# EAGLE design BusBlaster-v1 (EAGLE 5.10)
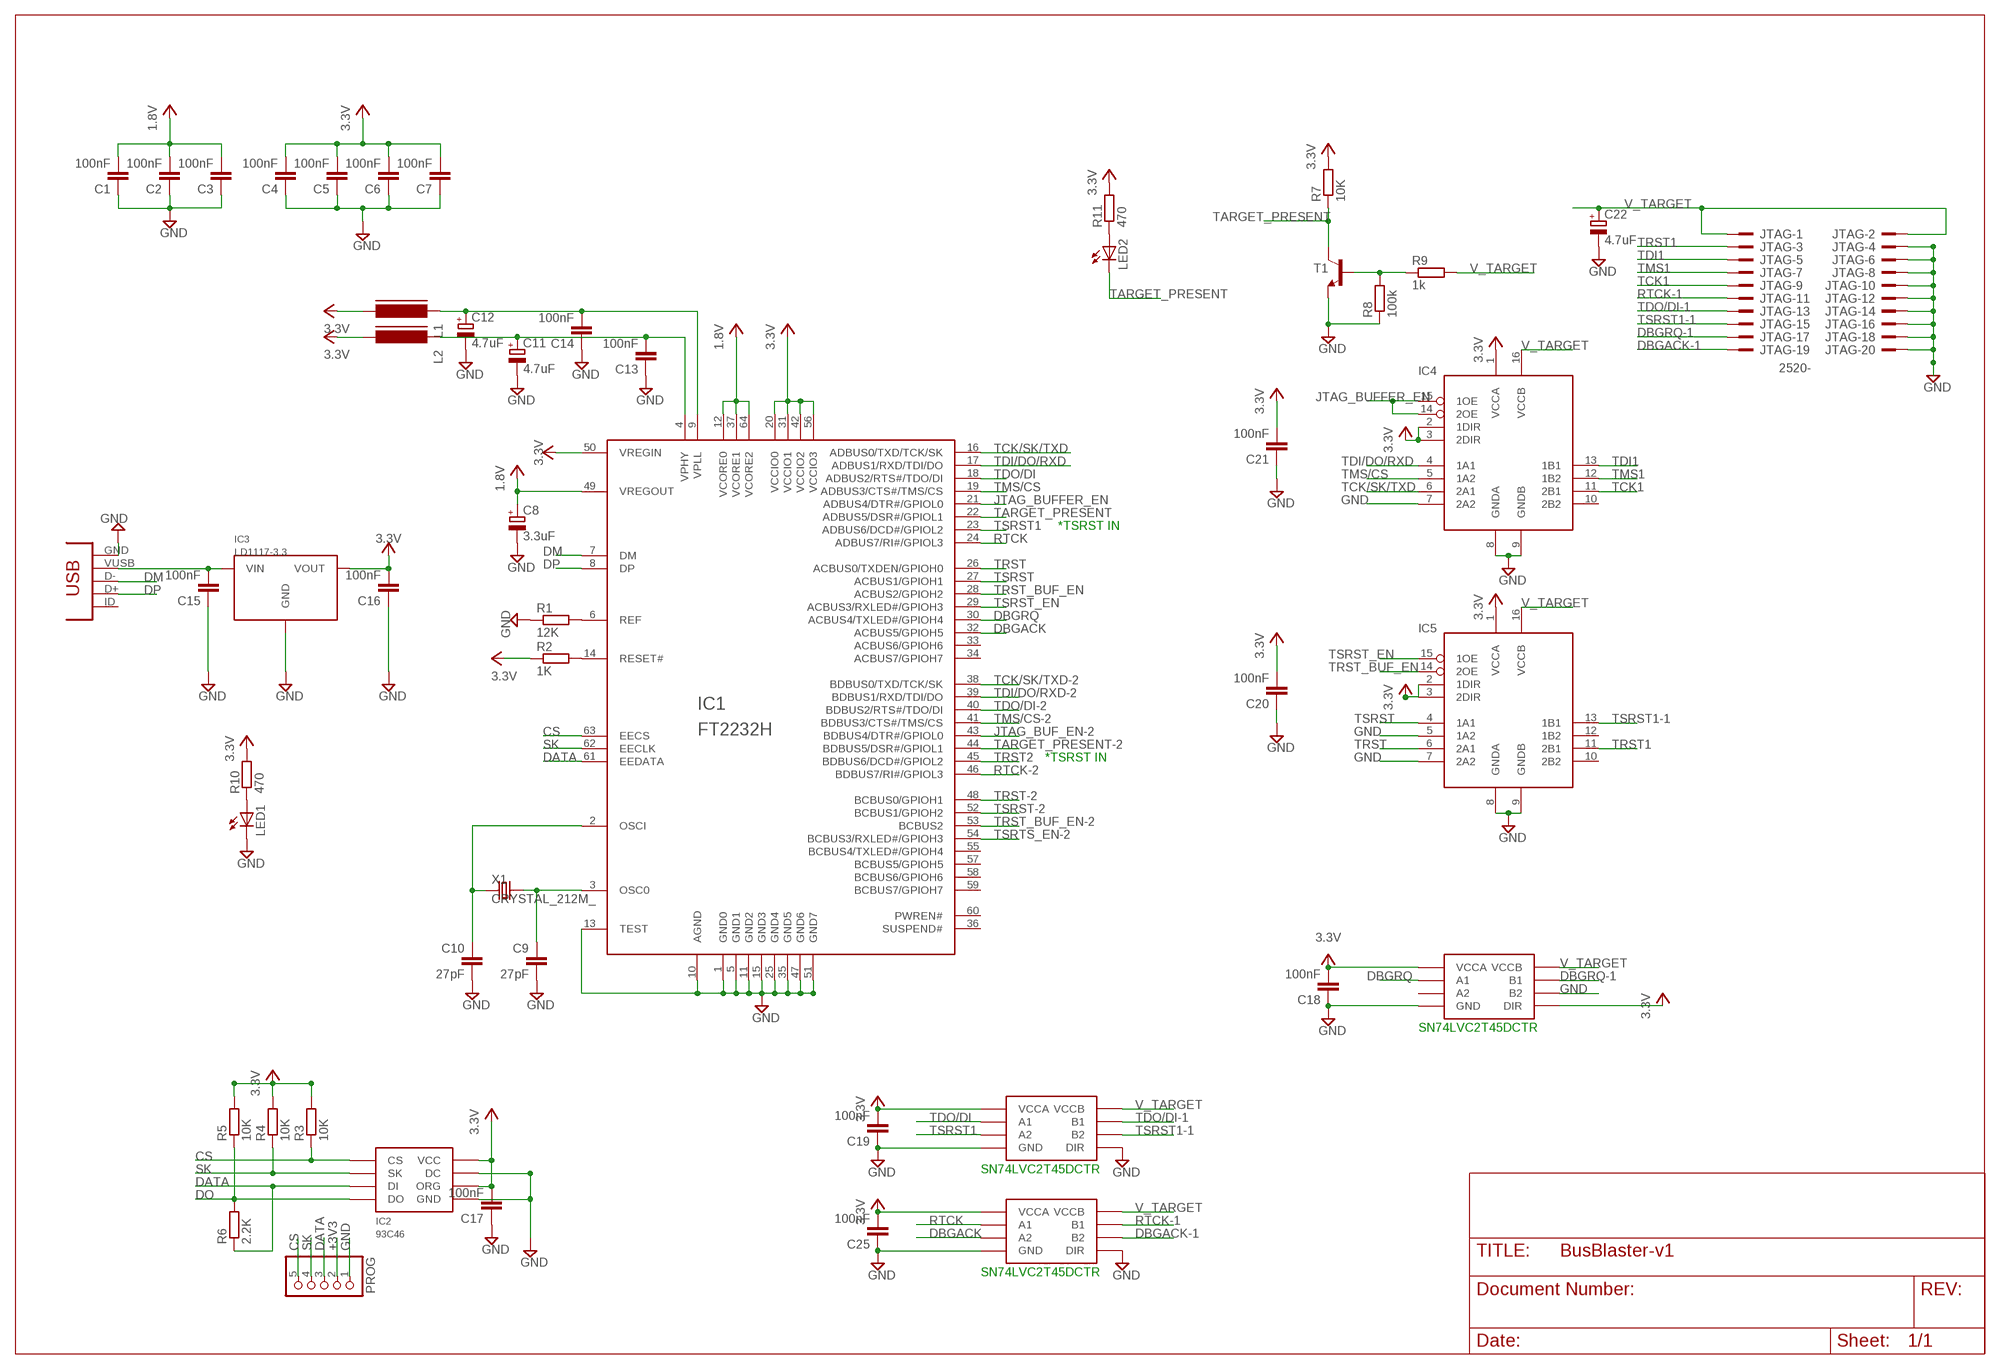
[diagram p0: schematic, sheet 1]

## Parts
C1  100nF  CAPC805  [C805]
C2  100nF  CAPC805  [C805]
C3  100nF  CAPC805  [C805]
C4  100nF  CAPC805  [C805]
C5  100nF  CAPC805  [C805]
C6  100nF  CAPC805  [C805]
C7  100nF  CAPC805  [C805]
C8  3.3uF  CAP_POLSMC_A  [SMC_A]
C9  27pF  CAPC805  [C805]
C10  27pF  CAPC805  [C805]
C11  4.7uF  CAP_POLSMC_A  [SMC_A]
C12  4.7uF  CAP_POLSMC_A  [SMC_A]
C13  100nF  CAPC805  [C805]
C14  100nF  CAPC805  [C805]
C15  100nF  CAPC805  [C805]
C16  100nF  CAPC805  [C805]
C17  100nF  CAPC805  [C805]
C18  100nF  CAPC805  [C805]
C19  100nF  CAPC805  [C805]
C20  100nF  CAPC805  [C805]
C21  100nF  CAPC805  [C805]
C22  4.7uF  CAP_POLSMC_A  [SMC_A]
C25  100nF  CAPC805  [C805]
CONN1  CONN_USB  [CONN_USB_MINI-B]
IC1  FT2232H  [LQFP64]
IC2  93C46  [SOIC8]
IC3  LD1117-3.3  [SOT223]
IC4  SN74AVC4T245PW  [TSSOP16]
IC5  SN74AVC4T245PW  [TSSOP16]
IC6  SN74LVC2T45DCTR  SN74AVC2T45DCT  [DCT_R_PDSO_G8]
IC7  SN74LVC2T45DCTR  SN74AVC2T45DCT  [DCT_R_PDSO_G8]
IC8  SN74LVC2T45DCTR  SN74AVC2T45DCT  [DCT_R_PDSO_G8]
JTAG  2520-  [PAK100/2500-20]
L1  FERRITE_BEAD805  [FB805]
L2  FERRITE_BEAD805  [FB805]
LED1  LEDCHIPLED_0805  [CHIPLED_0805]
LED2  LEDCHIPLED_0805  [CHIPLED_0805]
PROG  PINHD-1X5  [1X05]
R1  12K  RESISTORR805R805  [R805]
R2  1K  RESISTORR805R805  [R805]
R3  10K  RESISTORR805R805  [R805]
R4  10K  RESISTORR805R805  [R805]
R5  10K  RESISTORR805R805  [R805]
R6  2.2K  RESISTORR805R805  [R805]
R7  10K  RESISTORR805R805  [R805]
R8  100k  RESISTORR805R805  [R805]
R9  1k  RESISTORR805R805  [R805]
R10  470  RESISTORR805R805  [R805]
R11  470  RESISTORR805R805  [R805]
T1  NPNSOT23BEC  [SOT23-BEC]
X1  CRYSTAL_212M_  [4X6]

## Nets
1.8V: C1.2 C2.2 C3.2 C8.+ IC1.12(VCORE0) IC1.37(VCORE1) IC1.49(VREGOUT) IC1.64(VCORE2)
+3V3: C4.2 C5.2 C6.2 C7.2 C16.2 C17.2 C18.2 C19.2 C20.2 C21.2 C25.2 IC1.20(VCCIO0) IC1.31(VCCIO1) IC1.42(VCCIO2) IC1.50(VREGIN) IC1.56(VCCIO3) IC2.6(ORG) IC2.8(VCC) IC3.2(VOUT) IC4.1(VCCA) IC4.2(1DIR) IC4.3(2DIR) IC5.1(VCCA) IC5.2(1DIR) IC5.3(2DIR) IC6.1(VCCA) IC7.1(VCCA) IC8.1(VCCA) IC8.5(DIR) L1.2 L2.2 PROG.2 R2.1 R3.2 R4.2 R5.2 R7.2 R10.2 R11.2 ; supply symbol labelled 3.3V
CS: IC1.63(EECS) IC2.1(CS) PROG.5 R3.1
DATA: IC1.61(EEDATA) IC2.3(DI) PROG.3 R6.1
DBGACK: IC1.32(ACBUS5/GPIOH5) IC6.3(A2)
DBGACK-1: IC6.6(B2) JTAG.19
DBGRQ: IC1.30(ACBUS4/TXLED#/GPIOH4) IC8.2(A1)
DBGRQ-1: IC8.7(B1) JTAG.17
DM: CONN1.D- IC1.7(DM)
DO: IC2.4(DO) R5.1 R6.2
DP: CONN1.D+ IC1.8(DP)
GND: C1.1 C2.1 C3.1 C4.1 C5.1 C6.1 C7.1 C8.- C9.2 C10.2 C11.- C12.- C13.1 C14.1 C15.1 C16.1 C17.1 C18.1 C19.1 C20.1 C21.1 C22.- C25.1 CONN1.GND IC1.1(GND0) IC1.5(GND1) IC1.10(AGND) IC1.11(GND2) IC1.13(TEST) IC1.15(GND3) IC1.25(GND4) IC1.35(GND5) IC1.47(GND6) IC1.51(GND7) IC2.5(GND) IC2.7(DC) IC3.1(GND) IC4.7(2A2) IC4.8(GNDA) IC4.9(GNDB) IC5.5(1A2) IC5.7(2A2) IC5.8(GNDA) IC5.9(GNDB) IC6.4(GND) IC6.5(DIR) IC7.4(GND) IC7.5(DIR) IC8.4(GND) IC8.6(B2) JTAG.4 JTAG.6 JTAG.8 JTAG.10 JTAG.12 JTAG.14 JTAG.16 JTAG.18 JTAG.20 LED1.C PROG.1 R1.1 R8.1 T1.E
JTAG_BUF_EN-2: IC1.43(BDBUS4/DTR#/GPIOL0)
JTAG_BUFFER_EN: IC1.21(ADBUS4/DTR#/GPIOL0) IC4.14(2OE) IC4.15(1OE)
N$1: C9.1 IC1.3(OSC0) X1.2(X2)
N$2: C10.1 IC1.2(OSCI) X1.1(X1)
N$3: IC1.14(RESET#) R2.2
N$4: IC1.6(REF) R1.2
N$5: C15.2 CONN1.VUSB IC3.3(VIN)
N$6: LED1.A R10.1
N$7: R8.2 R9.1 T1.B
N$8: LED2.A R11.1
RTCK: IC1.24(ADBUS7/RI#/GPIOL3) IC6.2(A1)
RTCK-1: IC6.7(B1) JTAG.11
RTCK-2: IC1.46(BDBUS7/RI#/GPIOL3)
SK: IC1.62(EECLK) IC2.2(SK) PROG.4 R4.1
TARGET_PRESENT: IC1.22(ADBUS5/DSR#/GPIOL1) LED2.C R7.1 T1.C
TARGET_PRESENT-2: IC1.44(BDBUS5/DSR#/GPIOL1)
TCK1: IC4.11(2B1) JTAG.9
TCK/SK/TXD: IC1.16(ADBUS0/TXD/TCK/SK) IC4.6(2A1)
TCK/SK/TXD-2: IC1.38(BDBUS0/TXD/TCK/SK)
TDI1: IC4.13(1B1) JTAG.5
TDI/DO/RXD: IC1.17(ADBUS1/RXD/TDI/DO) IC4.4(1A1)
TDI/DO/RXD-2: IC1.39(BDBUS1/RXD/TDI/DO)
TDO/DI: IC1.18(ADBUS2/RTS#/TDO/DI) IC7.2(A1)
TDO/DI-1: IC7.7(B1) JTAG.13
TDO/DI-2: IC1.40(BDBUS2/RTS#/TDO/DI)
TMS1: IC4.12(1B2) JTAG.7
TMS/CS: IC1.19(ADBUS3/CTS#/TMS/CS) IC4.5(1A2)
TMS/CS-2: IC1.41(BDBUS3/CTS#/TMS/CS)
TRST: IC1.26(ACBUS0/TXDEN/GPIOH0) IC5.6(2A1)
TRST1: IC5.11(2B1) JTAG.3
TRST2: IC1.45(BDBUS6/DCD#/GPIOL2)
TRST-2: IC1.48(BCBUS0/GPIOH1)
TRST_BUF_EN: IC1.28(ACBUS2/GPIOH2) IC5.14(2OE)
TRST_BUF_EN-2: IC1.53(BCBUS2)
TSRST: IC1.27(ACBUS1/GPIOH1) IC5.4(1A1)
TSRST1: IC1.23(ADBUS6/DCD#/GPIOL2) IC7.3(A2)
TSRST1-1: IC5.13(1B1) IC7.6(B2) JTAG.15
TSRST-2: IC1.52(BCBUS1/GPIOH2)
TSRST_EN: IC1.29(ACBUS3/RXLED#/GPIOH3) IC5.15(1OE)
TSRTS_EN-2: IC1.54(BCBUS3/RXLED#/GPIOH3)
V_TARGET: C22.+ IC4.16(VCCB) IC5.16(VCCB) IC6.8(VCCB) IC7.8(VCCB) IC8.8(VCCB) JTAG.1 JTAG.2 R9.2
VPHY: C11.+ C13.2 IC1.4(VPHY) L2.1
VPLL: C12.+ C14.2 IC1.9(VPLL) L1.1
Unconnected: CONN1.BODY@1(BODY) CONN1.BODY@2(BODY) CONN1.BODY@3(BODY) CONN1.BODY@4(BODY) CONN1.ID(USBID) IC1.33(ACBUS6/GPIOH6) IC1.34(ACBUS7/GPIOH7) IC1.36(SUSPEND#) IC1.55(BCBUS4/TXLED#/GPIOH4) IC1.57(BCBUS5/GPIOH5) IC1.58(BCBUS6/GPIOH6) IC1.59(BCBUS7/GPIOH7) IC1.60(PWREN#) IC4.10(2B2) IC5.10(2B2) IC5.12(1B2) IC8.3(A2)

## Notes on the sheet
- *TSRST IN
- *TSRST IN
- SN74LVC2T45DCTR
- SN74LVC2T45DCTR
- SN74LVC2T45DCTR

## Library data of the parts
C1-C7 C9 C10 C13-C21 C25 = DP-EagleLibrary:CAP
C8 C11 C12 C22 = DP-EagleLibrary:CAP_POL
CONN1 = dp_devices:CONN_USB: USB connector
IC1 = DP-EagleLibrary:FT2232H: DUAL HIGH SPEED USB TO MULTIPURPOSE UART/FIFO IC
IC2 = DP-EagleLibrary:93C46
IC3 = DP-EagleLibrary:LD1117-3.3
IC4 IC5 = dp_devices:SN74AVC4T245
IC6-IC8 = dp_devices:SN74AVC2T45
JTAG = con-3m:2520-: 3M (TM) Pak 100 4-Wall Header Source: 3M
L1 L2 = DP-EagleLibrary:FERRITE_BEAD
LED1 LED2 = led:LED: LED OSRAM: - CHIPLED LG R971, LG N971, LY N971, LG Q971, LY Q971, LO R971, LY R971 LH N974, LH R974 LS Q976, LO Q976, LY Q976 LO Q996 - Hyper CHIPLED LW Q18S LB Q993, LB Q99A, LB R99A - SideLED LS A670, LO A670, LY A670, LG A670, LP A670 LB A673, LV A673, LT A673, LW A673 LH A674 LY A675 LS A676, LA A676, LO A676, LY A676, LW A676 LS A679, LY A679, LG A679 - Hyper Micro SIDELED® LS Y876, LA Y876, LO Y876, LY Y876 LT Y87S - SmartLED LW L88C, LW L88S LB L89C, LB L89S, LG L890 LS L89K, LO L89K, LY L89K LS L896, LA L896, LO L896, LY L896 - TOPLED LS T670, LO T670, LY T670, LG T670, LP T670 LSG T670, LSP T670, LSY T670, LOP T670, LYG T670 LG T671, LOG T671, LSG T671 LB T673, LV T673, LT T673, LW T673 LH T674 LS T676, LA T676, LO T676, LY T676, LB T676, LH T676, LSB T676, LW T676 LB T67C, LV T67C, LT T67C, LS T67K, LO T67K, LY T67K, LW E67C LS E67B, LA E67B, LO E67B, LY E67B, LB E67C, LV E67C, LT E67C LW T67C LS T679, LY T679, LG T679 LS T770, LO T770, LY T770, LG T770, LP T770 LB T773, LV T773, LT T773, LW T773 LH T774 LS E675, LA E675, LY E675, LS T675 LS T776, LA T776, LO T776, LY T776, LB T776 LHGB T686 LT T68C, LB T68C - Hyper Mini TOPLED® LB M676 - Mini TOPLED Santana® LG M470 LS M47K, LO M47K, LY M47K Source: http://www.osram.convergy.de LUXEON: - LUMILED® LXK2-PW12-R00, LXK2-PW12-S00, LXK2-PW14-U00, LXK2-PW14-V00 LXK2-PM12-R00, LXK2-PM12-S00, LXK2-PM14-U00 LXK2-PE12-Q00, LXK2-PE12-R00, LXK2-PE12-S00, LXK2-PE14-T00, LXK2-PE14-U00 LXK2-PB12-K00, LXK2-PB12-L00, LXK2-PB12-M00, LXK2-PB14-N00, LXK2-PB14-P00, LXK2-PB14-Q00 LXK2-PR12-L00, LXK2-PR12-M00, LXK2-PR14-Q00, LXK2-PR14-R00 LXK2-PD12-Q00, LXK2-PD12-R00, LXK2-PD12-S00 LXK2-PH12-R00, LXK2-PH12-S00 LXK2-PL12-P00, LXK2-PL12-Q00, LXK2-PL12-R00 Source: www.luxeon.com KINGBRIGHT: KA-3528ASYC Source: www.kingbright.com
PROG = pinhead:PINHD-1X5: PIN HEADER
R1-R11 = DP-EagleLibrary:RESISTOR
T1 = dp_devices:NPN: Most commonly used is SOT23-BEC
X1 = dp_devices:CRYSTAL_2

## Board
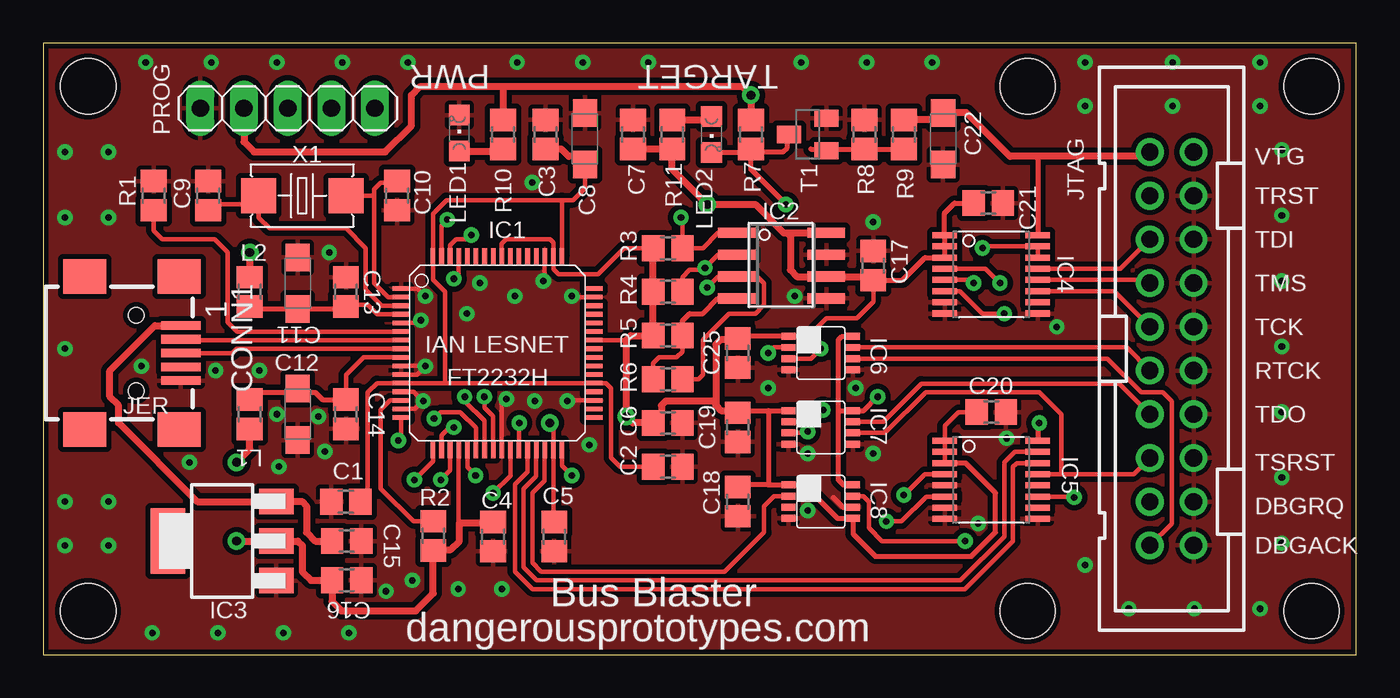
[diagram p1: board, top side]
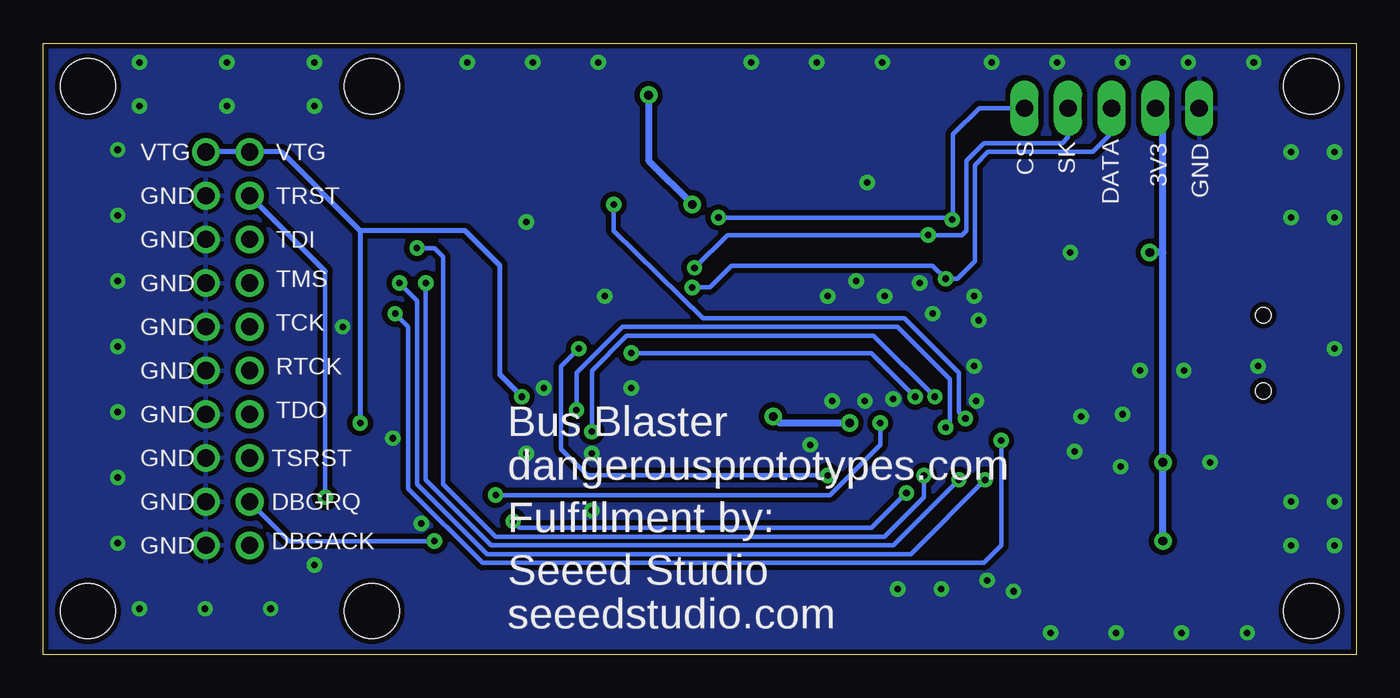
[diagram p2: board, bottom side, seen from below]

Size 76.35 x 35.54 mm. Coordinates in mm from the lower left corner, seen from the top.
Outline: 0,0 76.35,0 76.35,35.54 0,35.54 0,0
Copper layers (1*16): Top 0.035mm / dielectric 1.5mm / Bottom 0.035mm
Design rules "SparkFun - modified": minimum track width 8mil, minimum drill 15mil, track to track 8mil, track to pad 8mil, pad to pad 8mil, via to via 8mil, smd to smd 8mil, copper to edge 10mil, drill to drill 8mil, minimum pad ring 12mil, minimum via ring 10mil, stop-mask expansion 4mil, vias tented up to drill 25mil, thermal gap 10mil
Holes 3.2 mm at 2.62,2.54 2.62,33.02 57.23,33.02 57.23,2.54 73.74,33.02 73.74,2.54

### Footprints (pad centres in the part's own frame; a part is rotated, then mirrored left to right if it is on the bottom)
C805 = smd 1.3 x 1.5: 1 -0.85,0; 2 0.85,0
SMC_A = smd 1.6 x 1.4: + -1.5,0; - 1.5,0
CONN_USB_MINI-B = smd 2 x 2.5: BODY@1 -4.45,2.5; BODY@2 4.45,2.5; BODY@3 4.45,-3; BODY@4 -4.45,-3 | smd 0.5 x 2.3: D+ 0,2.6; D- -0.8,2.6; GND 1.6,2.6; ID 0.8,2.6; VUSB -1.6,2.6 | hole 0.9: -2.2,0; 2.2,0
LQFP64 = smd 1 x 0.27: 1 -5.6,3.75; 2 -5.6,3.25; 3 -5.6,2.75; 4 -5.6,2.25; 5 -5.6,1.75; 6 -5.6,1.25; 7 -5.6,0.75; 8 -5.6,0.25; 9 -5.6,-0.25; 10 -5.6,-0.75; 11 -5.6,-1.25; 12 -5.6,-1.75; 13 -5.6,-2.25; 14 -5.6,-2.75; 15 -5.6,-3.25; 16 -5.6,-3.75; 33 5.6,-3.75; 34 5.6,-3.25; 35 5.6,-2.75; 36 5.6,-2.25; 37 5.6,-1.75; 38 5.6,-1.25; 39 5.6,-0.75; 40 5.6,-0.25; 41 5.6,0.25; 42 5.6,0.75; 43 5.6,1.25; 44 5.6,1.75; 45 5.6,2.25; 46 5.6,2.75; 47 5.6,3.25; 48 5.6,3.75 | smd 0.27 x 1: 17 -3.75,-5.6; 18 -3.25,-5.6; 19 -2.75,-5.6; 20 -2.25,-5.6; 21 -1.75,-5.6; 22 -1.25,-5.6; 23 -0.75,-5.6; 24 -0.25,-5.6; 25 0.25,-5.6; 26 0.75,-5.6; 27 1.25,-5.6; 28 1.75,-5.6; 29 2.25,-5.6; 30 2.75,-5.6; 31 3.25,-5.6; 32 3.75,-5.6; 49 3.75,5.6; 50 3.25,5.6; 51 2.75,5.6; 52 2.25,5.6; 53 1.75,5.6; 54 1.25,5.6; 55 0.75,5.6; 56 0.25,5.6; 57 -0.25,5.6; 58 -0.75,5.6; 59 -1.25,5.6; 60 -1.75,5.6; 61 -2.25,5.6; 62 -2.75,5.6; 63 -3.25,5.6; 64 -3.75,5.6
SOIC8 = smd 0.6 x 2.2: 1 -1.905,-2.6; 2 -0.635,-2.6; 3 0.635,-2.6; 4 1.905,-2.6; 5 1.905,2.6; 6 0.635,2.6; 7 -0.635,2.6; 8 -1.905,2.6
SOT223 = smd 1.5 x 2: 1 -2.3,-3.15; 2 0,-3.15; 3 2.3,-3.15 | smd 3.8 x 2: 4 0,3.15
TSSOP16 = smd 0.35 x 1.43: 1 -2.275,-2.7; 2 -1.625,-2.7; 3 -0.975,-2.7; 4 -0.325,-2.7; 5 0.325,-2.7; 6 0.975,-2.7; 7 1.625,-2.7; 8 2.275,-2.7; 9 2.275,2.7; 10 1.625,2.7; 11 0.975,2.7; 12 0.325,2.7; 13 -0.325,2.7; 14 -0.975,2.7; 15 -1.625,2.7; 16 -2.275,2.7
DCT_R_PDSO_G8 = smd 0.4 x 0.8: 1 -0.975,-1.875; 2 -0.325,-1.875; 3 0.325,-1.875; 4 0.975,-1.875; 5 0.975,1.875; 6 0.325,1.875; 7 -0.325,1.875; 8 -0.975,1.875
PAK100/2500-20 = drill 1 pad 1.422 round: 1 -11.43,-1.27; 2 -11.43,1.27; 3 -8.89,-1.27; 4 -8.89,1.27; 5 -6.35,-1.27; 6 -6.35,1.27; 7 -3.81,-1.27; 8 -3.81,1.27; 9 -1.27,-1.27; 10 -1.27,1.27; 11 1.27,-1.27; 12 1.27,1.27; 13 3.81,-1.27; 14 3.81,1.27; 15 6.35,-1.27; 16 6.35,1.27; 17 8.89,-1.27; 18 8.89,1.27; 19 11.43,-1.27; 20 11.43,1.27
FB805 = smd 1.3 x 1.5: 1 -0.85,0; 2 0.85,0
CHIPLED_0805 = smd 1.2 x 1.2: A 0,-1.05; C 0,1.05
1X05 = drill 1.016 long: 1 -5.08,0; 2 -2.54,0; 3 0,0; 4 2.54,0; 5 5.08,0
R805 = smd 1.3 x 1.5: 1 -0.85,0; 2 0.85,0
SOT23-BEC = smd 1 x 1.4: B -0.95,-1.1; C 0,1.1; E 0.95,-1.1
4X6 = smd 2.032 x 2.032: 1 -2.54,0; 2 2.54,0

### Placement (x,y rotation side)
C1  17.61,8.89 0 top
C2  36.32,10.92 180 top
C3  29.21,30.23 270 top
C4  26.16,6.86 90 top
C5  29.72,6.86 90 top
C6  36.32,13.46 180 top
C7  34.29,30.23 270 top
C8  31.5,29.97 90 top
C9  9.61,26.67 90 top
C10  20.57,26.67 270 top
C11  14.81,21.59 90 top
C12  14.81,13.97 270 top
C13  17.61,21.08 270 top
C14  17.61,13.97 90 top
C15  17.65,6.6 180 top
C16  17.65,4.32 180 top
C17  48.26,22.61 270 top
C18  40.39,8.89 90 top
C19  40.39,13.21 90 top
C20  55.12,14.1 180 top
C21  54.94,26.24 180 top
C22  52.32,29.97 270 top
C25  40.39,17.53 90 top
CONN1  5.41,17.53 270 top
IC1  26.42,17.53 0 top
IC2  42.93,22.61 270 top
IC3  10.41,6.6 90 top
IC4  55.12,22.1 270 top
IC5  55.12,10.16 270 top
IC6  45.21,17.53 270 top
IC7  45.21,13.21 270 top
IC8  45.21,8.89 270 top
JTAG  65.61,17.78 270 top
L1  12.02,13.97 270 top
L2  12.02,21.08 90 top
LED1  24.2,30.31 0 top
LED2  38.86,30.23 180 top
PROG  14.22,31.75 0 top
R1  6.43,26.67 270 top
R2  22.69,6.91 90 top
R3  36.32,23.62 180 top
R4  36.32,21.08 180 top
R5  36.32,18.54 180 top
R6  36.32,16 180 top
R7  41.15,30.23 90 top
R8  47.75,30.23 270 top
R9  50.04,30.23 90 top
R10  26.75,30.23 90 top
R11  36.58,30.23 270 top
T1  44.45,30.23 90 top
U$1  [DP_LOGO]  36.96,5.59 0 top
U$2  [DP_LOGO]  74.5,8.94 90 top
U$3  [DP_LOGO]  11.81,10.16 0 bottom
X1  15.07,26.67 180 top

### Tracks (layer width: path | path; a pad name or v marks a point on that pad's centre or on a via)
1.8V
  Top 0.254: C2.2 33.53,10.92 33.02,11.43 33.02,15.49 32.74,15.78 IC1.37 23.37,15.78 | 23.37,15.78 IC1.12 19.41,15.78 18.88,15.24 18.88,9.31 C1.2 | 23.37,15.78 23.37,21.08 22.67,21.78 IC1.64 22.67,25.63 23.45,26.42 30.17,26.42 | 30.17,26.42 IC1.49 | C3.2 28.9,29.06 | 30.17,26.42 30.81,26.42 31.5,27.1 C8.+
  Top 0.406: C3.2 30.14,29.38 30.56,28.96 31.52,28.96 C8.+
+3V3  (via drill 0.51)
  Top 0.254: IC1.56 26.67,23.87 26.92,24.13 29.46,24.13 29.67,23.93 IC1.50 29.67,22.4 29.97,22.1 32.26,22.1 33.78,23.62 R3.2 | IC1.42 33.78,18.28 33.91,18.29 | v29.46,13.46 29.67,13.26 IC1.31 29.67,8.52 C5.2 | C20.2 53.21,14.1 52.42,13.3 IC5.1 IC5.2 IC5.3 | IC1.20 24.17,7.71 24.21,7.66 | IC6.1 44.49,18.5 45.55,19.56 47.32,19.56 48.26,20.49 C17.2
  Top 0.305: IC6.1 40.26,18.5 C25.2 | 42.16,14.18 40.26,14.18 C19.2 | 42.16,14.18 IC7.1 | 42.16,9.87 40.39,9.87 C18.2 | 42.16,9.87 IC8.1 44.24,9.87 46.19,7.92 IC8.5 47.09,7.01 48.39,5.71 53.98,5.71 55.37,7.11 55.37,9.4 53.63,11.13 IC5.3 | 42.16,14.18 42.16,9.87 | C17.2 49.95,21.76 51.27,23.07 IC4.3 IC4.2 IC4.1 52.4,24.39 52.4,25.65 52.99,26.24 C21.2
  Top 0.406: R3.2 R4.2 R5.2 34.16,18.54 33.91,18.29 v33.91,13.84 34.29,13.46 C6.2 35.94,13.93 35.94,14.48 36.2,14.73 39.12,14.73 | C17.2 48.05,21.97 IC2.6 43.81,21.97 43.43,22.35 43.43,24.32 43.34,24.41 43.43,24.51 | 43.43,24.51 43.05,24.51 41.4,26.16 v38.61,26.16 | 43.43,24.51 IC2.8 | R7.2 v41.15,32.51 40.64,33.02 26.75,33.02 | 40.26,14.18 39.41,14.18 39.12,14.48 39.12,14.73 | C25.2 40.04,18.29 39.37,18.29 39.12,18.03 39.12,14.73 | v38.61,26.16 38.43,26.16 | C4.2 26.11,7.66 24.21,7.66 24.21,6.6 23.7,6.1 22.73,6.1 R2.1 22.69,3.56 21.67,2.54 17.35,2.54 16.8,3.09 C16.2 15.57,4.32 15.07,4.83 15.07,6.35 14.81,6.6 IC3.2 v11.26,6.6 | v38.61,26.16 36.58,28.19 R11.2 C7.2 | PROG.2 11.68,29.8 12.27,29.21 19.89,29.21 21.42,30.73 21.42,32.51 21.92,33.02 26.75,33.02 | 26.75,33.02 R10.2 | L1.2 12.02,11.94 v11.26,11.18 | v12.02,23.37 L2.2
  Bottom 0.406: v29.46,13.46 33.53,13.46 v33.91,13.84 | v38.61,26.16 41.15,28.7 v41.15,32.51 | v11.26,6.6 v11.26,11.18 11.26,23.37 | 11.26,23.37 11.26,31.32 PROG.2 | 11.26,23.37 v12.02,23.37
CS  (via drill 0.38)
  Top 0.254: IC2.1 39.24,24.51 38.35,23.62 R3.1 37.17,25.31 v37.08,25.4 | IC1.63 23.17,24.94 v23.49,25.27
  Bottom 0.254: v37.08,25.4 23.62,25.4 v23.49,25.27 23.45,25.32 23.45,30.23 21.92,31.75 PROG.5
DATA  (via drill 0.38)
  Top 0.254: IC1.61 24.17,22.13 v23.88,21.84 | v38.61,21.34 39.24,21.97 IC2.3 41.53,21.97 41.91,21.59 41.91,20.32 41.4,19.81 39.88,19.81 38.35,18.29 38.35,16.26 38.1,16 R6.1
  Bottom 0.254: v38.61,21.34 37.59,21.34 36.32,22.61 24.64,22.61 v23.88,21.84 23.19,21.84 22.18,22.86 22.18,28.45 21.42,29.21 15.32,29.21 14.3,30.23 14.3,31.5 PROG.3
DBGACK  (via drill 0.38)
  Top 0.254: IC1.32 30.17,10.98 v30.73,10.41 | IC6.3 44.63,17.2 v45.21,17.78
  Bottom 0.254: v30.73,10.41 44.7,10.41 46.23,11.94 46.23,16.76 v45.21,17.78
DBGACK-1
  Top 0.254: IC6.6 61.87,17.2 63.83,15.24 65.1,15.24 65.61,14.73 65.61,7.62 JTAG.19
DBGRQ
  Top 0.254: IC1.30 29.17,10.12 28.45,9.4 28.45,5.33 28.96,4.83 39.62,4.83 41.91,7.11 41.91,8.64 42.49,9.21 IC8.2
DBGRQ-1  (via drill 0.38)
  Top 0.254: IC8.7 47.68,9.21 48.01,8.89 48.01,7.37 48.77,6.6 v53.59,6.6
  Bottom 0.254: v53.59,6.6 62.06,6.6 JTAG.17
DM
  Top 0.254: IC1.7 8.01,18.28 CONN1.D-
DO
  Top 0.254: R5.1 37.17,17.61 36.83,17.27 35.81,17.27 35.47,16.93 R6.2
  Top 0.305: IC2.4 39.24,20.7 38.35,19.81 37.59,19.81 37.17,19.39 R5.1
DP
  Top 0.254: IC1.8 11.25,17.78 11,17.53 CONN1.D+
GND  (via drill 0.38)
  Top 0.254: IC1.1 21.78,21.28 v22.22,20.83 | IC1.5 21.82,19.28 v21.97,19.43 | IC1.51 29.17,21.89 v29.08,21.72 | IC1.47 30.79,20.78 v30.73,20.83 | IC1.35 30.78,14.78 v30.48,14.73 | IC1.13 21.55,15.28 v22.1,14.73 21.64,14.28 IC1.15 | IC1.11 21.74,16.28 v22.22,16.76 22.21,16.78 IC1.10 | IC1.25 26.67,14.6 v26.92,14.86
  Top 0.305: IC8.6 46.51,8.56 45.93,9.14
  other vias: 28.45,27.43 43.69,20.83 42.16,15.49 44.45,11.68 48.26,11.68 47.24,15.49 48.26,25.15 54.36,7.62 44.45,8.38 58.93,19.05 56.01,12.57 16.64,23.37 12.57,16.51 16,13.84 8.51,11.18 5.71,16.76 10.03,16.51 3.81,6.35 1.27,6.35 3.81,8.89 1.27,8.89 6.35,1.27 10.16,1.27 13.97,1.27 17.78,1.27 24.13,3.81 26.67,3.81 1.27,17.78 1.27,25.4 1.27,29.21 3.81,29.21 3.81,25.4 25.4,21.59 24.64,19.81 27.43,20.83 28.57,14.73 31.75,12.19 5.97,34.42 9.78,34.42 13.59,34.42 17.4,34.42 21.21,34.42 27.56,34.42 31.37,34.42 35.18,34.42 44.07,34.42 47.88,34.42 51.69,34.42 60.58,34.42 65.66,34.42 60.58,31.88 65.66,31.88 70.74,31.88 70.74,34.42 72.01,29.34 72.01,25.53 72.01,21.72 72.01,17.91 72.01,14.1 72.01,10.29 72.01,6.48 70.74,2.67 66.93,2.67 63.12,2.67 60.58,5.21 19.94,3.68 21.46,4.32 13.72,10.92 16.38,11.81 13.59,13.97
  pour Bottom (isolate 0.305): 0,35.54 0,0 76.35,0 76.35,35.54
  pour Top (isolate 0.305): 0,35.54 0,0 76.35,0 76.35,35.54
JTAG_BUFFER_EN  (via drill 0.38)
  Top 0.254: IC1.21 24.67,10.89 v25.15,10.41 | v54.61,23.62 54.71,23.72 IC4.15 IC4.14
  Bottom 0.254: v25.15,10.41 25.15,9.14 27.43,6.86 50.04,6.86 53.09,9.91 53.09,23.11 53.59,23.62 v54.61,23.62
N$1
  Top 0.254: IC1.3 19.68,20.28 18.75,21.21 18.75,23.62 17.61,24.77 13.16,24.77 12.53,25.4 12.53,26.16 | 12.53,26.16 X1.2 | C9.1 9.64,25.82 9.99,26.16 12.53,26.16
N$2
  Top 0.254: IC1.2 20.07,20.78 19.26,21.59 19.26,26.67 | 19.26,26.67 19.26,27.05 19.64,27.43 20.49,27.43 C10.1 | 19.26,26.67 X1.1
N$3
  Top 0.254: IC1.14 20.19,14.78 19.64,14.22 19.64,9.65 21.53,7.75 R2.2
N$4
  Top 0.254: IC1.6 11.28,18.78 10.75,19.3 10.75,23.37 9.99,24.13 6.94,24.13 6.43,24.64 R1.2
N$5
  Top 0.406: C15.2 15.83,6.6 15.32,7.11 15.32,8.64 15.05,8.9 IC3.3 8.97,8.89 4.4,13.46 4.4,14.48 3.89,14.99 3.89,16.51 6.51,19.13 CONN1.VUSB
N$6
  Top 0.406: LED1.A 26.63,29.26 R10.1
N$7
  Top 0.305: R9.1 R8.2 44.63,29.38 T1.B
N$8
  Top 0.406: R11.1 38.66,31.08 LED2.A
RTCK  (via drill 0.38)
  Top 0.254: IC6.2 42.49,17.85 v42.16,17.53 | IC1.24 26.17,13.84 25.65,14.35 v25.65,14.99
  Bottom 0.254: v42.16,17.53 28.19,17.53 v25.65,14.99
RTCK-1
  Top 0.254: IC6.7 63,17.85 JTAG.11
SK  (via drill 0.38)
  Top 0.254: IC1.62 23.67,23.79 24,24.13 24.64,24.13 v24.89,24.38 | IC2.2 39.24,23.24 v38.48,22.48 38.35,22.35 37.59,22.35 37.17,21.93 R4.1
  Bottom 0.254: v38.48,22.48 36.58,24.38 v24.89,24.38 22.94,24.38 22.69,24.64 22.69,28.7 21.67,29.72 17.1,29.72 16.76,30.05 PROG.4
TARGET_PRESENT  (via drill 0.38)
  Top 0.254: IC1.22 25.17,13.19 24.26,14.1 23.11,14.1 v22.73,13.72
  Top 0.305: T1.C 43.26,30.14 43.26,29.46 43.01,29.21 41.31,29.21 R7.1 | LED2.C 40.95,29.18 R7.1 | R7.1 41.15,28.19 v43.18,26.16
  Bottom 0.254: v43.18,26.16 43.18,24.64 37.97,19.56 26.29,19.56 23.11,16.38 23.11,14.1 v22.73,13.72
TCK1
  Top 0.254: IC4.11 62.27,21.12 JTAG.9
TCK/SK/TXD  (via drill 0.38)
  Top 0.254: IC4.6 53.3,21.12 54.61,19.81 v55.88,19.81 | IC1.16 20.82,12.54 v20.65,12.45
  Bottom 0.254: v55.88,19.81 55.12,19.05 55.12,9.65 50.8,5.33 21.67,5.33 20.65,6.35 v20.65,12.45
TDI1
  Top 0.254: IC4.13 62.63,22.42 JTAG.5
TDI/DO/RXD  (via drill 0.38)
  Top 0.254: IC1.17 22.67,11.24 v21.59,10.16 | IC4.4 54.79,22.42 v55.63,21.59
  Bottom 0.254: v21.59,10.16 25.91,5.84 50.55,5.84 54.61,9.91 54.61,20.57 v55.63,21.59
TDO/DI  (via drill 0.38)
  Top 0.254: IC1.18 23.17,12.75 23.62,13.21 v23.88,13.21 | IC7.2 43.89,13.53 44.2,13.84 44.96,13.84 v45.34,14.22
  Bottom 0.254: v23.88,13.21 23.62,13.46 23.62,16 26.67,19.05 42.67,19.05 45.34,16.38 v45.34,14.22
TDO/DI-1
  Top 0.254: IC7.7 48.84,13.53 51.05,15.75 62.56,15.75 JTAG.13
TMS1
  Top 0.254: IC4.12 64.16,21.77 JTAG.7
TMS/CS  (via drill 0.38)
  Top 0.254: IC1.19 23.67,10.71 v23.11,10.16 | IC4.5 53.92,21.77 v54.1,21.59
  Bottom 0.254: v23.11,10.16 26.92,6.35 50.29,6.35 54.1,10.16 v54.1,21.59
TRST  (via drill 0.38)
  Top 0.254: IC1.26 27.17,10.4 v26.16,9.4 | IC5.6 51.35,9.19 49.91,7.75 v49.02,7.75
  Bottom 0.254: v26.16,9.4 28.19,7.37 48.64,7.37 v49.02,7.75
TRST1  (via drill 0.38)
  Top 0.254: IC5.11 59.9,9.19 v59.94,9.14
  Bottom 0.254: v59.94,9.14 59.94,22.27
  Bottom 0.305: 59.94,22.27 JTAG.3
TRST_BUF_EN
  Top 0.254: IC1.28 28.17,10.64 27.43,9.91 27.43,4.83 28.45,3.81 53.59,3.81 56.39,6.6 56.39,10.92 56.6,11.13 IC5.14
TSRST  (via drill 0.38)
  Top 0.254: IC1.27 27.67,13.44 v27.69,13.46 | IC5.4 51.25,10.48 v50.04,9.27
  Bottom 0.254: v27.69,13.46 27.69,12.19 30.61,9.27 v50.04,9.27
TSRST1  (via drill 0.38)
  Top 0.254: IC1.23 25.67,13.58 24.51,14.73 v24.51,14.99 | IC7.3 44.38,12.88 v44.45,12.95
  Bottom 0.254: v44.45,12.95 44.45,16.51 42.42,18.54 28.07,18.54 v24.51,14.99
TSRST1-1
  Top 0.254: 59.18,10.48 IC5.13 | IC7.6 48.95,12.88 51.31,15.24 57.91,15.24 59.18,13.97 59.18,10.48 | 59.18,10.48 63.4,10.48 JTAG.15
TSRST_EN
  Top 0.254: IC1.29 28.67,10.38 27.94,9.65 27.94,5.08 28.7,4.32 53.34,4.32 55.88,6.86 55.88,11.18 56.49,11.79 IC5.15
V_TARGET  (via drill 0.38)
  Top 0.305: 46.27,14.18 IC7.8 47.71,14.18 v48.51,14.99 | 46.27,14.18 46.23,14.22 46.23,18.29 46.44,18.5 IC6.8 | IC8.8 46.52,9.87 46.23,10.16 46.23,14.14 46.27,14.18 | IC5.16 57.82,13.37 v57.91,13.46 | 57.83,24.38 IC4.16 57.82,28.88 57.74,28.96
  Top 0.406: JTAG.1 64.09,28.96 57.74,28.96 56.21,28.96 53.67,31.5 52.09,31.5 C22.+ 52.18,31.08 R9.2
  Bottom 0.305: v48.51,14.99 49.78,16.26 49.78,22.61 51.82,24.64 57.91,24.64 | 57.91,24.64 v57.91,13.46 | 57.91,24.64 62.48,29.21 JTAG.1 JTAG.2
VPHY
  Top 0.254: IC1.4 19.42,19.78 18.88,20.32 17.77,20.32 C13.2
  Top 0.305: C13.2 17.52,20.23 17.38,20.09 C11.+ 12.25,20.09 12.11,20.23 L2.1
VPLL
  Top 0.254: IC1.9 18.63,17.28 17.61,16.26 C14.2
  Top 0.305: L1.1 12.36,14.82 12.78,15.24 14.07,15.24 C12.+ 14.53,15.24 15.83,15.24 16.25,14.82 C14.2

### Text on the board
tNames: PWR | TARGET | VTG | TRST | TDI | TMS | TCK | IAN LESNET | RTCK | JER | TDO | TSRST | DBGRQ | DBGACK | Bus Blaster | dangerousprototypes.com
bNames: GND | 3V3 | DATA | SK | CS | VTG | VTG | TRST | GND | TDI | GND | TMS | GND | TCK | GND | RTCK | GND | TDO | Bus Blaster | GND | TSRST | GND | dangerousprototypes.com | DBGRQ | GND | Fulfillment by: | DBGACK | GND | Seeed Studio | seeedstudio.com